# Altium schematic sheet rx.SchDoc
size A
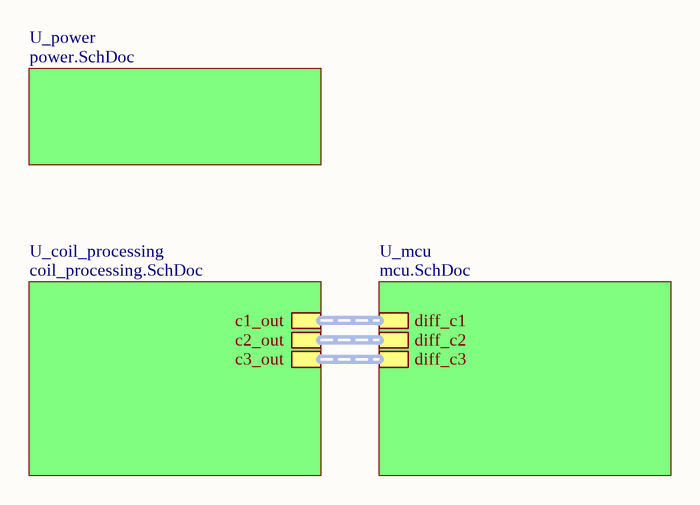
[diagram p0: rx.SchDoc]

## Sub-sheets
U_coil_processing = coil_processing.SchDoc: c2_out (harness diff_signal), c3_out (harness diff_signal), c1_out (harness diff_signal)
U_mcu = mcu.SchDoc: diff_c1 (harness diff_signal), diff_c2 (harness diff_signal), diff_c3 (harness diff_signal)
U_power = power.SchDoc: no entries

## Buses and harness runs
harness sheet U_coil_processing/c1_out = sheet U_mcu/diff_c1
harness sheet U_coil_processing/c2_out = sheet U_mcu/diff_c2
harness sheet U_coil_processing/c3_out = sheet U_mcu/diff_c3